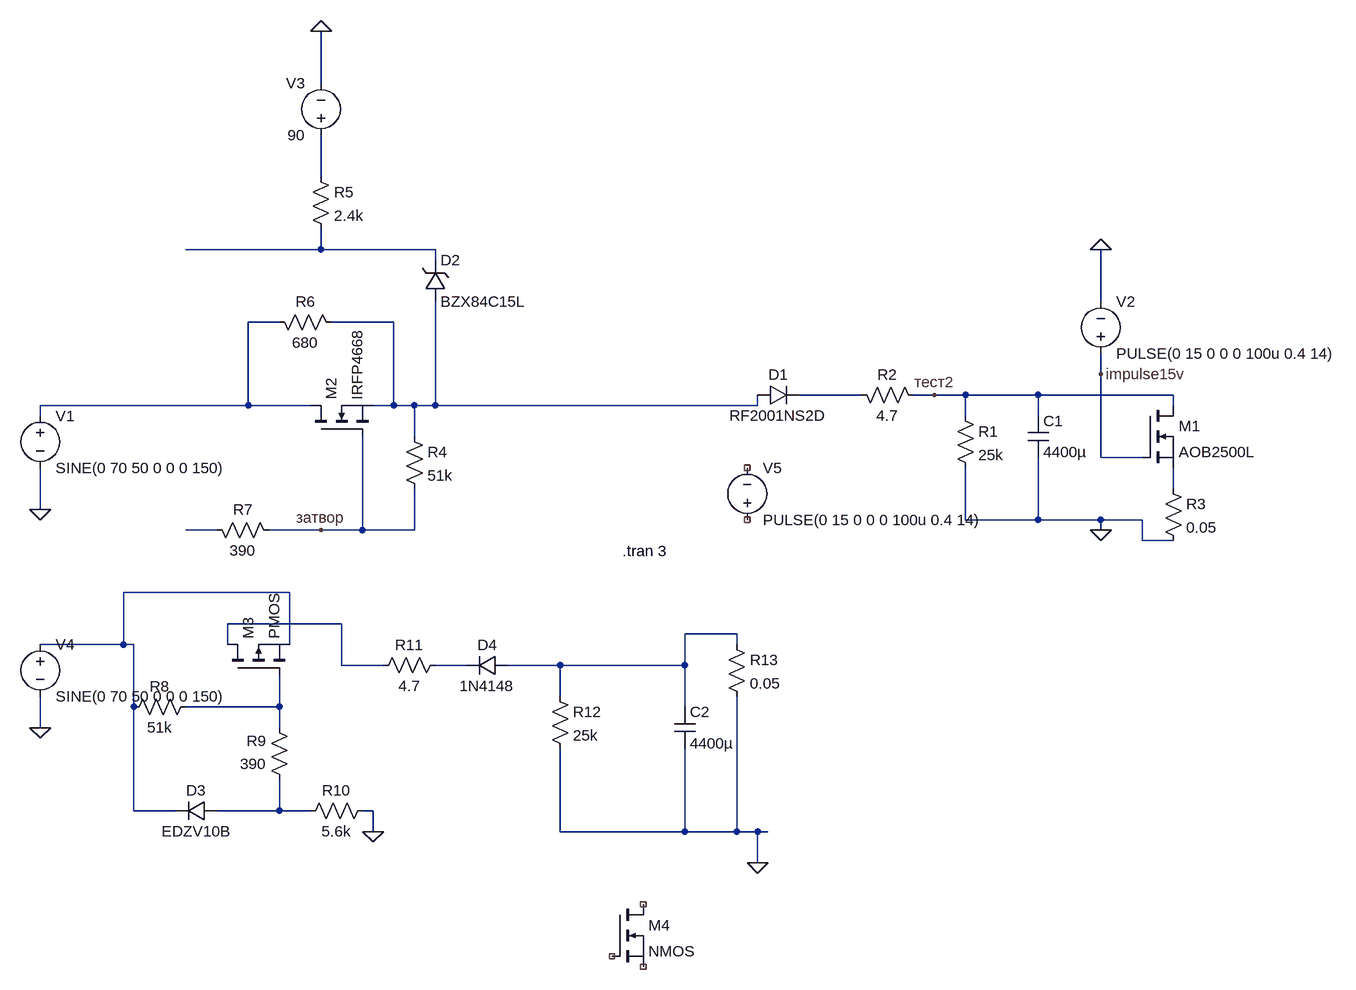
[diagram p0: schematic ChargeCapacitorFULL.asc]
ChargeCapacitorFULL.asc, the LTspice schematic file:
Version 4.1
SHEET 1 880 1016
WIRE -896 -352 -896 -432
WIRE -896 -208 -896 -272
WIRE -896 -96 -896 -128
WIRE -896 -96 -1104 -96
WIRE -720 -96 -896 -96
WIRE -720 -80 -720 -96
WIRE 304 -16 304 -96
WIRE -960 16 -1008 16
WIRE -784 16 -880 16
WIRE 304 96 304 64
WIRE -64 128 -160 128
WIRE 48 128 16 128
WIRE 96 128 48 128
WIRE 208 128 96 128
WIRE 416 128 208 128
WIRE -1008 144 -1008 16
WIRE -1008 144 -1328 144
WIRE -912 144 -1008 144
WIRE -784 144 -784 16
WIRE -784 144 -816 144
WIRE -752 144 -784 144
WIRE -720 144 -720 -16
WIRE -720 144 -752 144
WIRE -224 144 -224 128
WIRE -224 144 -720 144
WIRE 416 144 416 128
WIRE -1328 160 -1328 144
WIRE 96 160 96 128
WIRE 208 160 208 128
WIRE -752 192 -752 144
WIRE 304 224 304 96
WIRE 368 224 304 224
WIRE 416 272 416 240
WIRE -1328 304 -1328 240
WIRE 96 320 96 240
WIRE 208 320 208 224
WIRE 208 320 96 320
WIRE 304 320 208 320
WIRE 368 320 304 320
WIRE -1056 336 -1104 336
WIRE -896 336 -976 336
WIRE -832 336 -832 192
WIRE -832 336 -896 336
WIRE -752 336 -752 272
WIRE -752 336 -832 336
WIRE 304 336 304 320
WIRE 368 352 368 320
WIRE 416 352 368 352
WIRE -944 432 -1200 432
WIRE -864 480 -1040 480
WIRE -256 496 -336 496
WIRE -1200 512 -1200 432
WIRE -1200 512 -1328 512
WIRE -1184 512 -1200 512
WIRE -1040 512 -1040 480
WIRE -944 512 -944 432
WIRE -256 512 -256 496
WIRE -864 544 -864 480
WIRE -800 544 -864 544
WIRE -672 544 -720 544
WIRE -528 544 -608 544
WIRE -336 544 -336 496
WIRE -336 544 -528 544
WIRE -528 592 -528 544
WIRE -1184 608 -1184 512
WIRE -960 608 -960 560
WIRE -960 608 -1104 608
WIRE -336 608 -336 544
WIRE -1328 640 -1328 592
WIRE -960 640 -960 608
WIRE -1184 768 -1184 608
WIRE -1120 768 -1184 768
WIRE -960 768 -960 720
WIRE -960 768 -1056 768
WIRE -912 768 -960 768
WIRE -816 768 -832 768
WIRE -816 800 -816 768
WIRE -528 800 -528 672
WIRE -336 800 -336 672
WIRE -336 800 -528 800
WIRE -256 800 -256 592
WIRE -256 800 -336 800
WIRE -224 800 -256 800
WIRE -208 800 -224 800
WIRE -224 848 -224 800
FLAG 304 336 0
FLAG -1328 304 0
FLAG 304 -96 0
FLAG -896 -432 0
FLAG 304 96 impulse15v
FLAG -896 336 затвор
FLAG 48 128 тест2
FLAG -1328 640 0
FLAG -816 800 0
FLAG -224 848 0
DATAFLAG -1184 144 ""
DATAFLAG -848 -96 ""
DATAFLAG -944 336 ""
SYMBOL res 80 144 R0
SYMATTR InstName R1
SYMATTR Value 25k
SYMBOL res -80 112 M90
WINDOW 0 0 56 VBottom 2
WINDOW 3 32 56 VTop 2
SYMATTR InstName R2
SYMATTR Value 4.7
SYMBOL cap 192 160 R0
SYMATTR InstName C1
SYMATTR Value 4400µ
SYMBOL nmos 368 144 R0
SYMATTR InstName M1
SYMATTR Value AOB2500L
SYMBOL res 400 256 R0
SYMATTR InstName R3
SYMATTR Value 0.05
SYMBOL diode -224 112 M90
WINDOW 0 0 32 VBottom 2
WINDOW 3 32 32 VTop 2
SYMATTR InstName D1
SYMATTR Value RF2001NS2D
SYMBOL voltage -1328 144 R0
WINDOW 123 0 0 Left 0
WINDOW 39 0 0 Left 0
SYMATTR InstName V1
SYMATTR Value SINE(0 70 50 0 0 0 150)
SYMBOL voltage 304 80 M180
WINDOW 0 24 96 Left 2
WINDOW 3 24 16 Left 2
WINDOW 123 0 0 Left 0
WINDOW 39 0 0 Left 0
SYMATTR InstName V2
SYMATTR Value PULSE(0 15 0 0 0 100u 0.4 14)
SYMBOL zener -736 -16 M180
WINDOW 0 24 64 Left 2
WINDOW 3 24 0 Left 2
SYMATTR InstName D2
SYMATTR Value BZX84C15L
SYMATTR Description Diode
SYMATTR Type diode
SYMBOL voltage -896 -256 R180
WINDOW 0 24 96 Left 2
WINDOW 3 24 16 Left 2
WINDOW 123 0 0 Left 0
WINDOW 39 0 0 Left 0
SYMATTR InstName V3
SYMATTR Value 90
SYMBOL nmos -912 192 R270
SYMATTR InstName M2
SYMATTR Value IRFP4668
SYMBOL res -912 -224 R0
SYMATTR InstName R5
SYMATTR Value 2.4k
SYMBOL res -976 0 M90
WINDOW 0 0 56 VBottom 2
WINDOW 3 32 56 VTop 2
SYMATTR InstName R6
SYMATTR Value 680
SYMBOL res -768 176 R0
SYMATTR InstName R4
SYMATTR Value 51k
SYMBOL res -1072 320 M90
WINDOW 0 0 56 VBottom 2
WINDOW 3 32 56 VTop 2
SYMATTR InstName R7
SYMATTR Value 390
SYMBOL pmos -1040 560 R270
SYMATTR InstName M3
SYMBOL voltage -1328 496 R0
WINDOW 123 0 0 Left 0
WINDOW 39 0 0 Left 0
SYMATTR InstName V4
SYMATTR Value SINE(0 70 50 0 0 0 150)
SYMBOL res -1088 592 R90
WINDOW 0 0 56 VBottom 2
WINDOW 3 32 56 VTop 2
SYMATTR InstName R8
SYMATTR Value 51k
SYMBOL res -944 736 R180
WINDOW 0 36 76 Left 2
WINDOW 3 36 40 Left 2
SYMATTR InstName R9
SYMATTR Value 390
SYMBOL diode -1056 752 R90
WINDOW 0 0 32 VBottom 2
WINDOW 3 32 32 VTop 2
SYMATTR InstName D3
SYMATTR Value EDZV10B
SYMATTR Description Diode
SYMATTR Type diode
SYMBOL res -816 752 R90
WINDOW 0 0 56 VBottom 2
WINDOW 3 32 56 VTop 2
SYMATTR InstName R10
SYMATTR Value 5.6k
SYMBOL res -816 560 R270
WINDOW 0 32 56 VTop 2
WINDOW 3 0 56 VBottom 2
SYMATTR InstName R11
SYMATTR Value 4.7
SYMBOL diode -608 528 R90
WINDOW 0 0 32 VBottom 2
WINDOW 3 32 32 VTop 2
SYMATTR InstName D4
SYMATTR Value 1N4148
SYMBOL res -544 576 R0
SYMATTR InstName R12
SYMATTR Value 25k
SYMBOL cap -352 608 R0
SYMATTR InstName C2
SYMATTR Value 4400µ
SYMBOL res -272 496 R0
SYMATTR InstName R13
SYMATTR Value 0.05
SYMBOL voltage -240 336 M180
WINDOW 0 24 96 Left 2
WINDOW 3 24 16 Left 2
WINDOW 123 0 0 Left 0
WINDOW 39 0 0 Left 0
SYMATTR InstName V5
SYMATTR Value PULSE(0 15 0 0 0 100u 0.4 14)
SYMBOL nmos -448 912 R0
SYMATTR InstName M4
TEXT -432 368 Left 2 !.tran 3

The netlist it stands for:
* ChargeCapacitorFULL.asc
R1 тест2 0 25k
R2 N005 тест2 4.7
C1 тест2 0 4400µ
M1 тест2 impulse15v N006 N006 AOB2500L
R3 N006 0 0.05
D1 N004 N005 RF2001NS2D
V1 N003 0 SINE(0 70 50 0 0 0 150)
V2 impulse15v 0 PULSE(0 15 0 0 0 100u 0.4 14)
D2 N004 N002 BZX84C15L
V3 N001 0 90
M2 N003 затвор N004 N004 IRFP4668
R5 N001 N002 2.4k
R6 N003 N004 680
R4 N004 затвор 51k
R7 N007 затвор 390
M3 N009 N012 N008 N008 PMOS
V4 N008 0 SINE(0 70 50 0 0 0 150)
R8 N012 N008 51k
R9 N013 N012 390
D3 N013 N008 EDZV10B
R10 0 N013 5.6k
R11 N009 N011 4.7
D4 N010 N011 1N4148
R12 N010 0 25k
C2 N010 0 4400µ
R13 N010 0 0.05
V5 NC_01 NC_02 PULSE(0 15 0 0 0 100u 0.4 14)
M4 NC_03 NC_04 NC_05 NC_05 NMOS
.model D D
.lib standard.dio
.model NMOS NMOS
.model PMOS PMOS
.lib standard.mos
.tran 3
.backanno
.end